# Altium project bg_per.PrjPcb
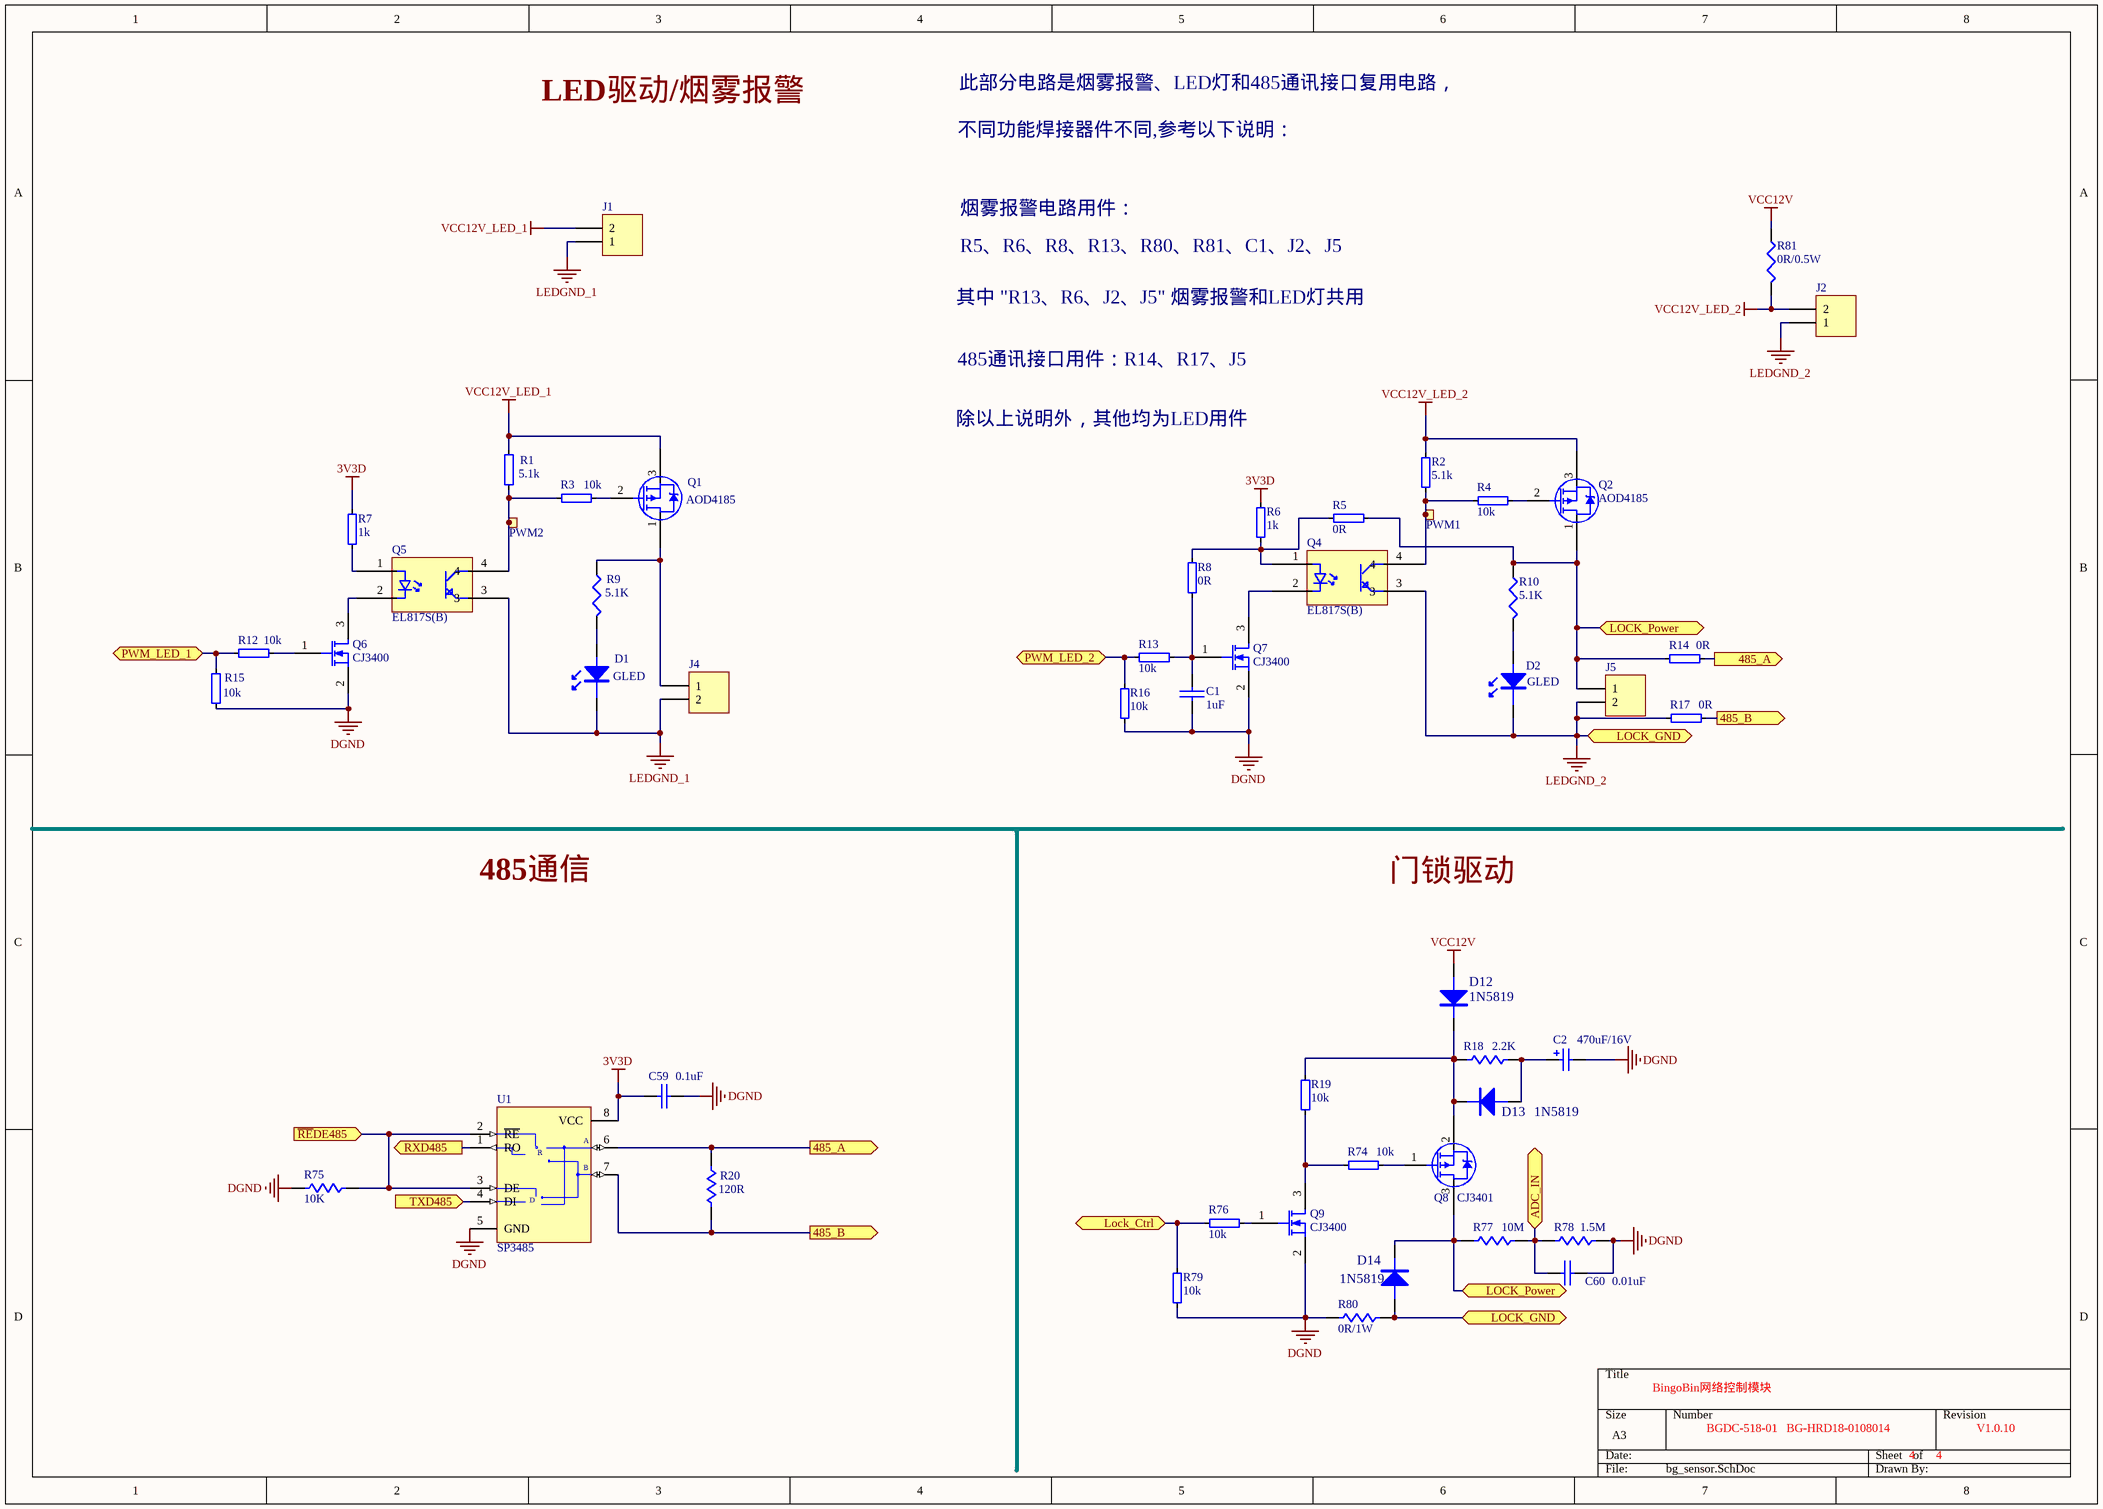
[diagram p0: bg_sensor.SchDoc]
3 sheets, 112 parts. Net scope: flat (ports and power ports of the same name join across sheets).
Board file: bg_PCB.PcbDoc
Sheets:
  bg_sensor.SchDoc
  bg_MCU.SchDoc
  view.SchDoc

## Sheet bg_sensor.SchDoc
size A3

### Parts
C1  1uF  [C0603]
C2  470uF/16V  [C10*10.5mm]
C59  0.1uF  [C0603]
C60  0.01uF  [C0603]
D1  GLED  [LED-0805]
D2  GLED  [LED-0805]
D12  1N5819  [SOD123]
D13  1N5819  [SOD123]
D14  1N5819  [SOD123]
J1  36-57VDC RTN  [MKDS_5_6.35]  (value not drawn)
J2  36-57VDC RTN  [MKDS_5_6.35]  (value not drawn)
J4  36-57VDC RTN  [MKDS_5_6.35]  (value not drawn)
J5  36-57VDC RTN  [MKDS_5_6.35]  (value not drawn)
PWM1  ?.0mm,SMD  [TP_SMD_1mm]  (value not drawn)  (no BOM)
PWM2  ?.0mm,SMD  [TP_SMD_1mm]  (value not drawn)  (no BOM)
Q1  AOD4185  [TO252]
Q2  AOD4185  [TO252]
Q4  EL817S(B)  [LC_SMD-4]
Q5  EL817S(B)  [LC_SMD-4]
Q6  CJ3400  [sot-23]
Q7  CJ3400  [sot-23]
Q8  CJ3401  [sot-23]
Q9  CJ3400  [sot-23]
R1  5.1k  [R0603]
R2  5.1k  [R0603]
R3  10k  [R0603]
R4  10k  [R0603]
R5  0R  [R0603]
R6  1k  [R0603]
R7  1k  [R0603]
R8  0R  [R0603]
R9  5.1K  [R0603]
R10  5.1K  [R0603]
R12  10k  [R0603]
R13  10k  [R0603]
R14  0R  [R0603]
R15  10k  [R0603]
R16  10k  [R0603]
R17  0R  [R0603]
R18  2.2K  [0805]
R19  10k  [R0603]
R20  120R  [R0603]
R74  10k  [R0603]
R75  10K  [R0603]
R76  10k  [R0603]
R77  10M  [R0603]
R78  1.5M  [R0603]
R79  10k  [R0603]
R80  0R/1W  [2512]
R81  0R/0.5W  [1206]
U1  SP3485  [SOIC8]

### Ports
485_A (out), 485_B (out), ADC_IN, Lock_Ctrl, LOCK_GND, LOCK_Power, PWM_LED_1, PWM_LED_2, RXD485 (out), TXD485 (in), ~{RE}DE485 (in)

### Nets
3V3D: C59.1 R6.2 R7.2 U1.8(VCC)
DGND: C1.1 C2.2 C59.2 C60.2 Q6.2(S) Q7.2(S) Q9.2(S) R15.1 R16.1 R75.2 R78.1 R79.1 R80.2 U1.5(GND)
LEDGND_1: D1.2 J1.1 J4.2 Q5.3
LEDGND_2: D2.2 D14.1(A) J2.1 J5.2 Q4.3 R17.1 R80.1 ; port LOCK_GND
VCC12V: D12.1(A) R81.1
VCC12V_LED_1: J1.2 Q1.3(S) R1.2
VCC12V_LED_2: J2.2 Q2.3(S) R2.2 R81.2
NetC1_2: C1.2 Q7.1(G) R8.2 R13.2
NetC2_1: C2.1 D13.1(A) R18.2
NetC60_1: C60.1 R77.1 R78.2 ; port ADC_IN
NetD1_1: D1.1 R9.2
NetD2_1: D2.1 R10.2
NetD12_2: D12.2(K) D13.2(K) Q8.2(S) R18.1 R19.2
NetD14_2: D14.2(K) J5.1 Q2.1(D) Q8.3(D) R5.1 R10.1 R14.1 R77.2 ; port LOCK_Power
NetJ4_1: J4.1 Q1.1(D) R9.1
NetPWM1_1: PWM1.1 Q4.4 R2.1 R4.1
NetPWM2_1: PWM2.1 Q5.4 R1.1 R3.1
NetQ1_2: Q1.2(G) R3.2
NetQ2_2: Q2.2(G) R4.2
NetQ4_1: Q4.1 R5.2 R6.1 R8.1
NetQ4_2: Q4.2 Q7.3(D)
NetQ5_1: Q5.1 R7.1
NetQ5_2: Q5.2 Q6.3(D)
NetQ6_1: Q6.1(G) R12.2
NetQ8_1: Q8.1(G) R74.2
NetQ9_1: Q9.1(G) R76.2
NetQ9_3: Q9.3(D) R19.1 R74.1
NetR12_1: R12.1 R15.2 ; port PWM_LED_1
NetR13_1: R13.1 R16.2 ; port PWM_LED_2
NetR14_2: R14.2 R20.2 U1.6(A) ; port 485_A
NetR17_2: R17.2 R20.1 U1.7(B) ; port 485_B
NetR75_1: R75.1 U1.2(~{RE}) U1.3(DE) ; port ~{RE}DE485
NetR76_1: R76.1 R79.2 ; port Lock_Ctrl
NetU1_1: U1.1(RO) ; port RXD485
NetU1_4: U1.4(DI) ; port TXD485

### Notes on the sheet
- LED驱动/烟雾报警
- 此部分电路是烟雾报警、LED灯和485通讯接口复用电路，
- 不同功能焊接器件不同,参考以下说明：
- 烟雾报警电路用件：
- 其中 "R13、R6、J2、J5" 烟雾报警和LED灯共用
- R5、R6、R8、R13、R80、R81、C1、J2、J5
- 485通讯接口用件：R14、R17、J5
- 除以上说明外，其他均为LED用件
- 485通信
- 门锁驱动
- BingoBin网络控制模块
- BGDC-518-01   BG-HRD18-0108014
- 4
- V1.0.10
- (in symbol SP3485) R; D

### Library data of the parts
C1 C59 C60 = C0603: Capacitor, Ceramic, 0.1uF, 16V, 10%, 0603, X7R
  C1: Value: 1uF
  C59: Value: 0.1uF
  C60: Value: 0.01uF
C2 = Cap Pol2: Capacitor, Aluminum Electrolytic, 470uF,16V, 20%; Published: 8-Jun-2000; LatestRevisionDate: 17-Jul-2002; LatestRevisionNote: Re-released for DXP Platform.; PackageReference: POLAR0.8; Publisher: Altium Limited; PackageDescription: Polarized Capacitor; 2 Leads; Value: 470uF/16V
D1 D2 = LED_0805: 翠绿色 贴片LED ( Iv=220-270mcd @IF=5mA)
D12-D14 = DIODE: Diode Schottky, 40V,1A
J1 J2 J4 J5 = Header 2: WJ15EDGVC-3.81-2P; LatestRevisionDate: 17-Jul-2002; LatestRevisionNote: Re-released for DXP Platform.; Publisher: Altium Limited
PWM1 PWM2 = TESTPAD: 1.0mm circular SMD testpad; Part Number: TP_SMD_?.0MM; Manufacturer: Nordic Semiconductor; Artikkelnr Noca: N.A.; Manufacturer Part Number: *; Datasheet: *; LatestRevisionDate: 2013-06-11; Pin Count: 1; Publisher: Nordic Semiconductor; Published: 2013-06-11; Value: ?.0mm,SMD; Note: *; Supplier: *; Supplier part number: *; 2nd source Supplier: *; 2nd source part number: *; Footprint Doc: TP_SMD_?.0mm; Artikkelnr Simpro: N.A.
Q1 Q2 = PMOS: AOD4185(TO-252-2)
Q4 Q5 = Optocoupler: EL817S(B)(TU)-F
Q6 Q7 Q9 = MOSFET-N: N沟道,30V,5.6A,27mΩ(Typ,@Vgs=4.5V); Published: 8-Jun-2000; LatestRevisionDate: 17-Jul-2002; LatestRevisionNote: Re-released for DXP Platform.; PackageVersion: 1995/1996; PackageReference: E3; Publisher: Altium Limited; PackageDescription: TO, Flat Index; 3 In-Line, Axial Leads; Body Dia. 4.6mm; Lead Dia. 0.5 mm (max)
Q8 = PMOS-2: CJ3401(SOT-23-3)
R1-R8 R12-R17 R19 R74 R76 R79 = R0402-12k: RES, THICK FILM, 10K, 5%, 1/10W, 0603; Part Number: R0402-10k; Note: Chip Res 1%; Artikkelnr Noca: 27049099; Manufacturer: *; Manufacturer Part Number: *; Datasheet: *; Footprint: 0402; LatestRevisionDate: 2009-11-23; Pin Count: 2; Publisher: Nordic Semiconductor; Published: 2009-05-08; Supplier: Farnell; Supplier part number: 173-8865; 2nd source Supplier: *; 2nd source part number: *
  R1 R2: Value: 5.1k
  R3 R4 R12 R13 R15 R16 R19 R74 R76 R79: Value: 10k
  R5 R8 R14 R17: Value: 0R
  R6 R7: Value: 1k
R9 R10 = Res3: RES, THICK FILM, 1K, 5%, 1/10W, 0603; Published: 8-Jun-2000; LatestRevisionDate: 29-May-2009; LatestRevisionNote: IPC-7351 Footprint Added.; PackageReference: J1-0603; Publisher: Altium Limited; PackageDescription: Chip Resistor; Value: 5.1K
R18 = R0603: RES, THICK FILM, 2.2K, 5%, 1/8W, 0805; Value: 2.2K
R20 = R0603: RES, THICK FILM, 120 OHM, 5%, 1/10W, 0603; Value: 120R
R75 = R0603: RES, THICK FILM, 10K, 5%, 1/10W, 0603; Value: 10K
R77 = R0603: RES, THICK FILM, 10M, 5%, 1/10W, 0603; Value: 10M
R78 R80 = R0603: RES, THICK FILM, 1.5M, 5%, 1/10W, 0603
  R78: Value: 1.5M
  R80: Value: 0R/1W
R81 = Res3: RES, THICK FILM, 0.39 OHM, 1%, 3/4W, 2010; Published: 8-Jun-2000; LatestRevisionDate: 29-May-2009; LatestRevisionNote: IPC-7351 Footprint Added.; PackageReference: J1-0603; Publisher: Altium Limited; PackageDescription: Chip Resistor; Value: 0R/0.5W
U1 = SP3485: +3.3V Low Power Half-Duplex RS-485 Transceiver with 10Mbps Data Rate

## Sheet bg_MCU.SchDoc
size A2
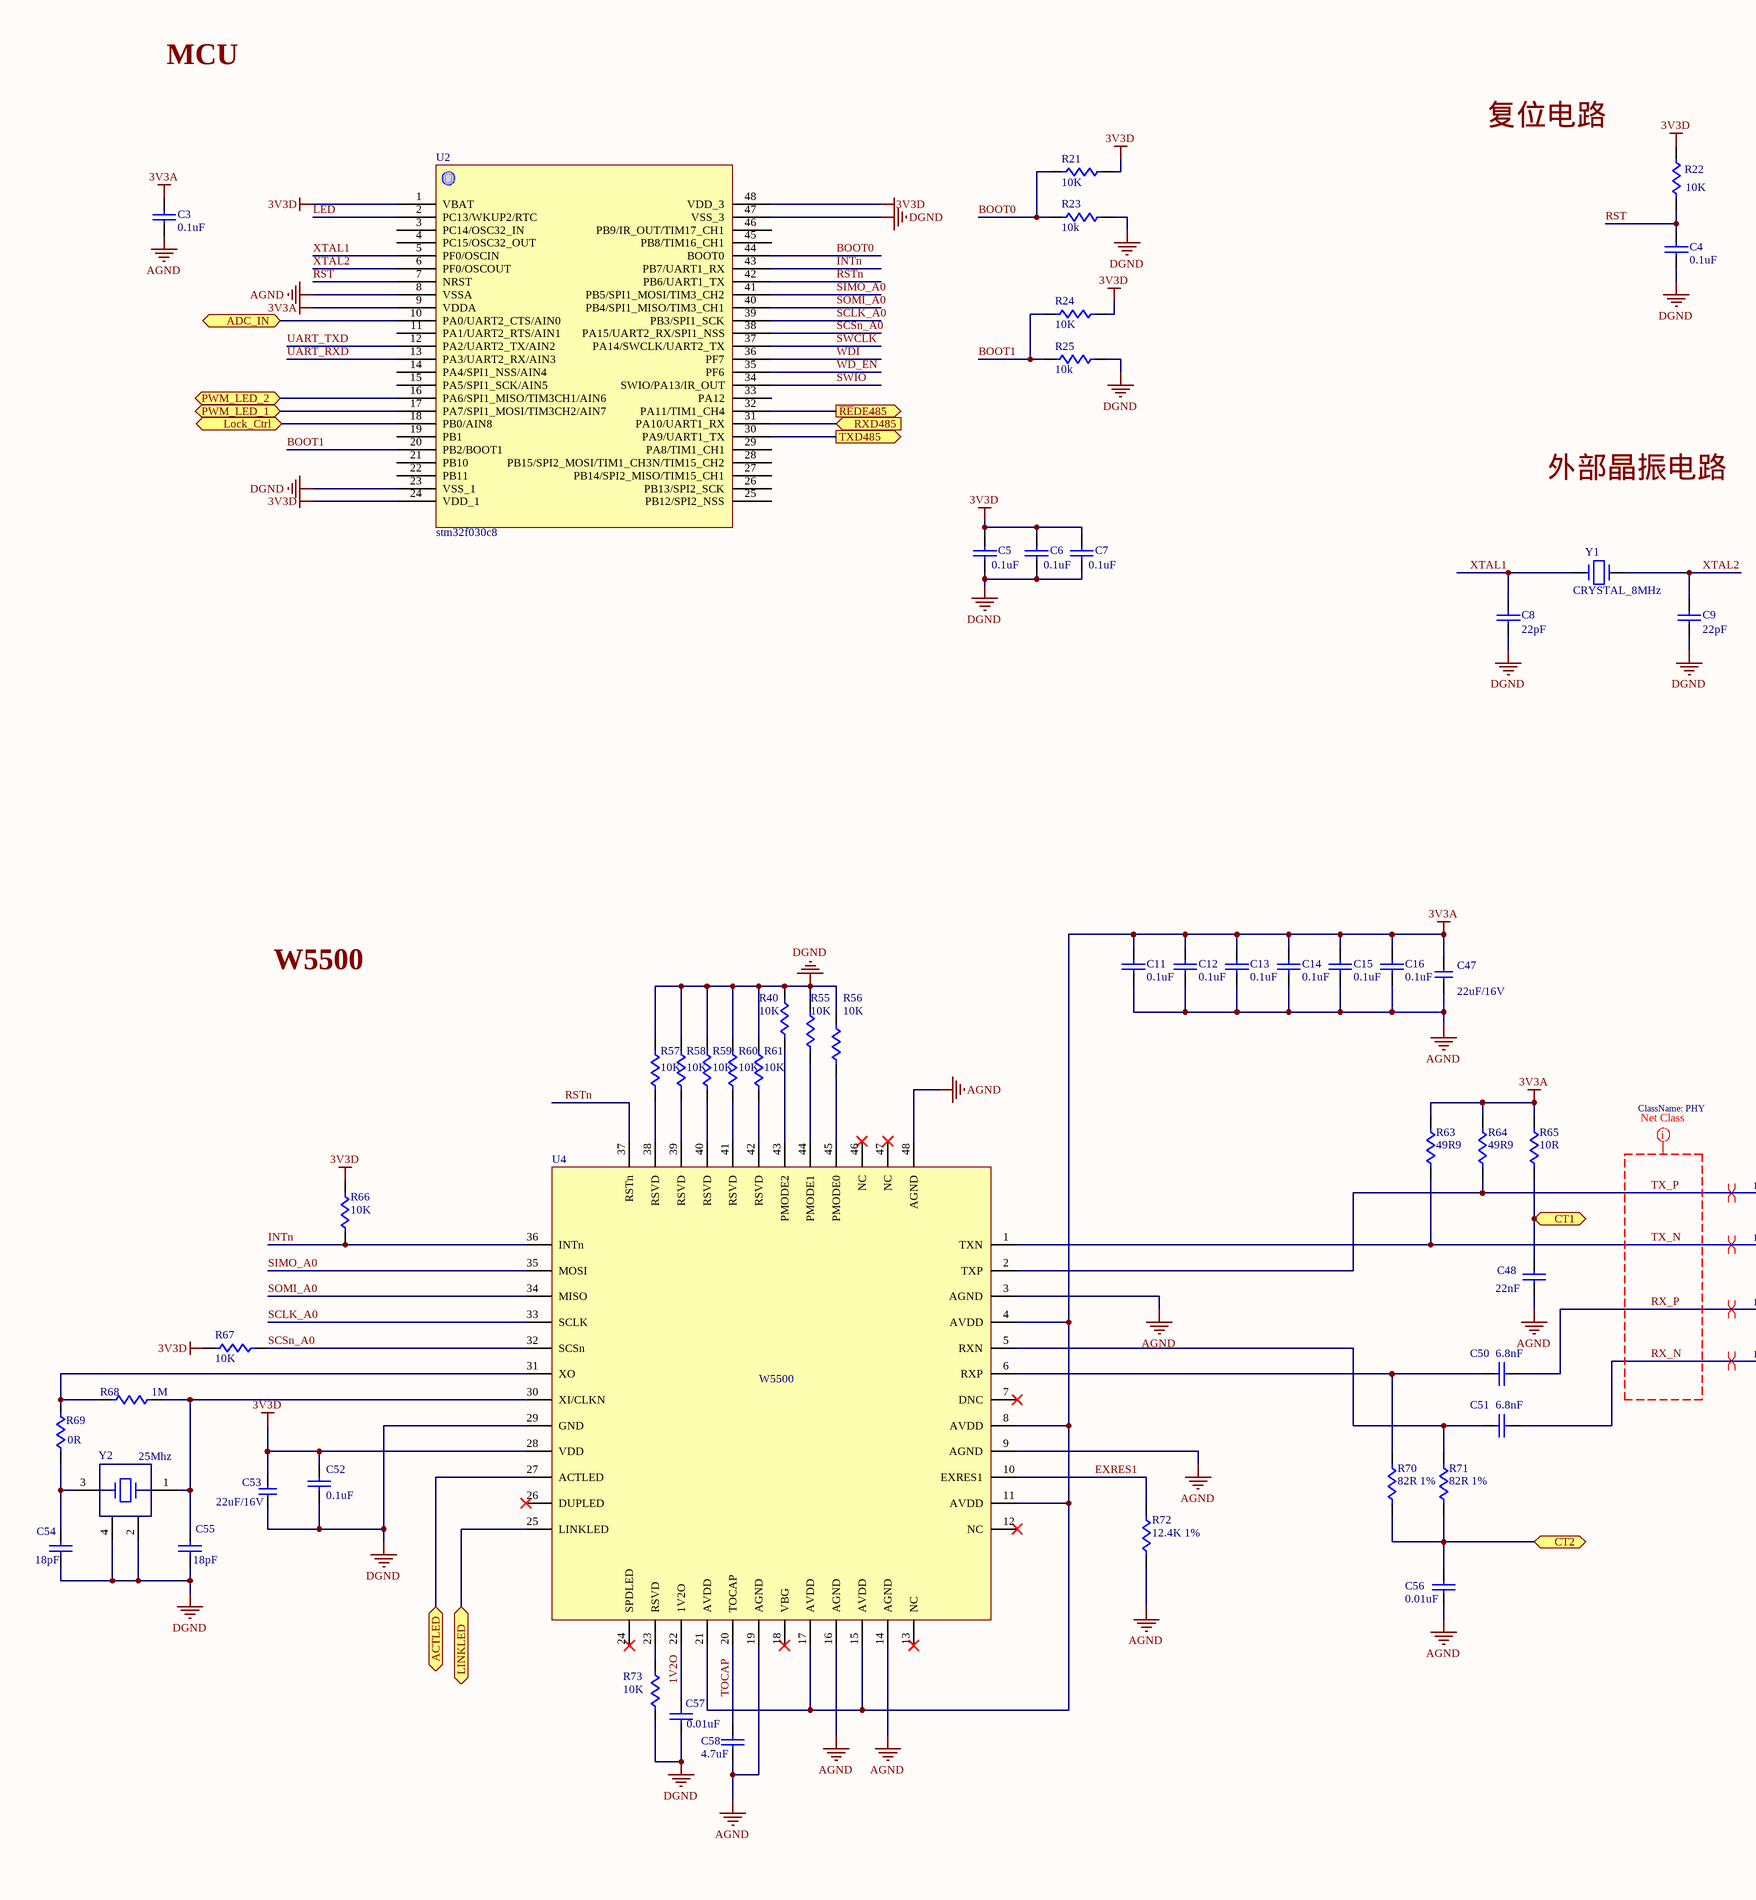
[diagram p1: bg_MCU.SchDoc, left]
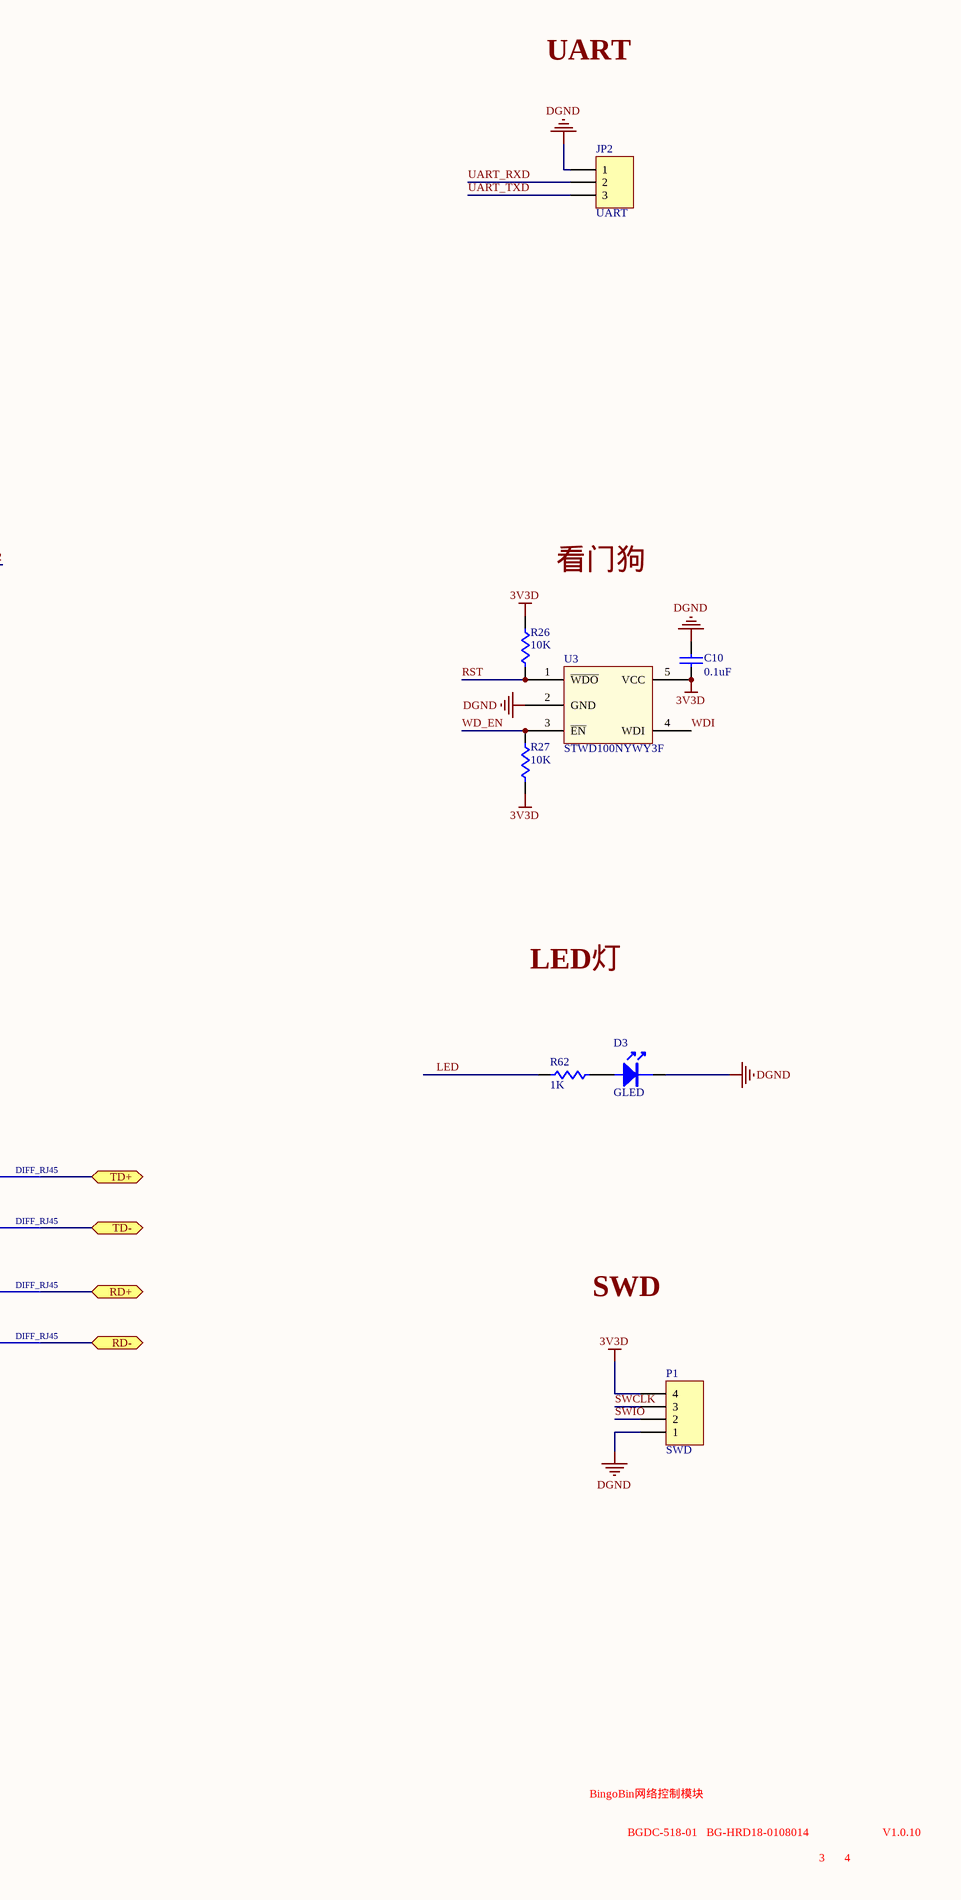
[diagram p2: bg_MCU.SchDoc, right]

### Parts
C3  0.1uF  [C0603]
C4  0.1uF  [C0603]
C5  0.1uF  [C0603]
C6  0.1uF  [C0603]
C7  0.1uF  [C0603]
C8  22pF  [C0603]
C9  22pF  [C0603]
C10  0.1uF  [C0603]
C11  0.1uF  [C0603]
C12  0.1uF  [C0603]
C13  0.1uF  [C0603]
C14  0.1uF  [C0603]
C15  0.1uF  [C0603]
C16  0.1uF  [C0603]
C47  22uF/16V  [C1210]
C48  22nF  [C0603]
C50  6.8nF  [C0603]
C51  6.8nF  [C0603]
C52  0.1uF  [C0603]
C53  22uF/16V  [C1210]
C54  18pF  [C0603]
C55  18pF  [C0603]
C56  0.01uF  [C0603]
C57  0.01uF  [C0603]
C58  4.7uF  [C0603]
D3  GLED  [LED-0805]
JP2  UART  [HDR1X3]
P1  SWD  [HDR1X4]
R21  10K  [R0603]
R22  10K  [R0603]
R23  10k  [R0603]
R24  10K  [R0603]
R25  10k  [R0603]
R26  10K  [R0603]
R27  10K  [R0603]
R40  10K  [R0603]
R55  10K  [R0603]
R56  10K  [R0603]
R57  10K  [R0603]
R58  10K  [R0603]
R59  10K  [R0603]
R60  10K  [R0603]
R61  10K  [R0603]
R62  1K  [R0603]
R63  49R9  [R0603]
R64  49R9  [R0603]
R65  10R  [R0603]
R66  10K  [R0603]
R67  10K  [R0603]
R68  1M  [R0603]
R69  0R  [R0603]
R70  82R 1%  [R0603]
R71  82R 1%  [R0603]
R72  12.4K 1%  [R0603]
R73  10K  [R0603]
U2  stm32f030c8  [LQFP48]
U3  STWD100NYWY3F  [SOT23-5]
U4  W5500  [W5500-LQFP-48_7x7x05P]
Y1  CRYSTAL_8MHz  [8M_SMD_CRYSTAL]
Y2  25Mhz  [25MHz-SMD-3225_4P]

### Ports
ACTLED (bidir), ADC_IN, CT1 (bidir), CT2 (bidir), LINKLED (bidir), Lock_Ctrl, PWM_LED_1, PWM_LED_2, RD+ (bidir), RD- (bidir), RXD485 (in), TD+ (bidir), TD- (bidir), TXD485 (out), ~{RE}DE485 (out)

### Nets
3V3A: C3.1 C11.1 C12.1 C13.1 C14.1 C15.1 C16.1 C47.2 R63.2 R64.2 R65.2 U2.9(VDDA) U4.4(AVDD) U4.8(AVDD) U4.11(AVDD) U4.15(AVDD) U4.17(AVDD) U4.21(AVDD)
3V3D: C5.2 C6.2 C7.2 C10.2 C52.1 C53.2 P1.4 R21.1 R22.2 R24.1 R26.2 R27.1 R66.2 R67.2 U2.1(VBAT) U2.24(VDD_1) U2.48(VDD_3) U3.5(VCC) U4.28(VDD)
AGND: C3.2 C11.2 C12.2 C13.2 C14.2 C15.2 C16.2 C47.1 C48.2 C56.2 C58.2 R72.1 U2.8(VSSA) U4.3(AGND) U4.9(AGND) U4.14(AGND) U4.16(AGND) U4.19(AGND) U4.48(AGND)
DGND: C4.1 C5.1 C6.1 C7.1 C8.2 C9.2 C10.1 C52.2 C53.1 C54.2 C55.2 C57.2 D3.2 JP2.1 P1.1 R23.1 R25.1 R40.2 R55.2 R56.2 R57.2 R58.2 R59.2 R60.2 R61.2 R73.1 U2.23(VSS_1) U2.47(VSS_3) U3.2(GND) U4.29(GND) Y2.2 Y2.4
1V2O: C57.1 U4.22(1V2O)
BOOT0: R21.2 R23.2 U2.44(BOOT0)
BOOT1: R24.2 R25.2 U2.20(PB2/BOOT1)
EXRES1: R72.2 U4.10(EXRES1)
INTn: R66.1 U2.43(PB7/UART1_RX) U4.36(INTn)
LED: R62.2 U2.2(PC13/WKUP2/RTC)
RST: C4.2 R22.1 R26.1 U2.7(NRST) U3.1(~{WDO})
RSTn: U2.42(PB6/UART1_TX) U4.37(RSTn)
RX_N: C51.2 ; port RD-
RX_P: C50.2 ; port RD+
SCLK_A0: U2.39(PB3/SPI1_SCK) U4.33(SCLK)
SCSn_A0: R67.1 U2.38(PA15/UART2_RX/SPI1_NSS) U4.32(SCSn)
SIMO_A0: U2.41(PB5/SPI1_MOSI/TIM3_CH2) U4.35(MOSI)
SOMI_A0: U2.40(PB4/SPI1_MISO/TIM3_CH1) U4.34(MISO)
SWCLK: P1.3 U2.37(PA14/SWCLK/UART2_TX)
SWIO: P1.2 U2.34(SWIO/PA13/IR_OUT)
TOCAP: C58.1 U4.20(TOCAP)
TX_N: R63.1 U4.1(TXN) ; port TD-
TX_P: R64.1 U4.2(TXP) ; port TD+
UART_RXD: JP2.2 U2.13(PA3/UART2_RX/AIN3)
UART_TXD: JP2.3 U2.12(PA2/UART2_TX/AIN2)
WD_EN: R27.2 U2.35(PF6) U3.3(~{EN})
WDI: U2.36(PF7) U3.4(WDI)
XTAL1: C8.1 U2.5(PF0/OSCIN) Y1.1
XTAL2: C9.1 U2.6(PF0/OSCOUT) Y1.2
NetC48_1: C48.1 R65.1 ; port CT1
NetC50_1: C50.1 R70.2 U4.6(RXP)
NetC51_1: C51.1 R71.2 U4.5(RXN)
NetC54_1: C54.1 R69.1 Y2.3
NetC55_1: C55.1 R68.1 U4.30(XI/CLKN) Y2.1
NetC56_1: C56.1 R70.1 R71.1 ; port CT2
NetC60_1: U2.10(PA0/UART2_CTS/AIN0) ; port ADC_IN
NetD3_1: D3.1 R62.1
NetR12_1: U2.17(PA7/SPI1_MOSI/TIM3CH2/AIN7) ; port PWM_LED_1
NetR13_1: U2.16(PA6/SPI1_MISO/TIM3CH1/AIN6) ; port PWM_LED_2
NetR40_1: R40.1 U4.43(PMODE2)
NetR55_1: R55.1 U4.44(PMODE1)
NetR56_1: R56.1 U4.45(PMODE0)
NetR57_1: R57.1 U4.38(RSVD)
NetR58_1: R58.1 U4.39(RSVD)
NetR59_1: R59.1 U4.40(RSVD)
NetR60_1: R60.1 U4.41(RSVD)
NetR61_1: R61.1 U4.42(RSVD)
NetR68_2: R68.2 R69.2 U4.31(XO)
NetR73_2: R73.2 U4.23(RSVD)
NetR75_1: U2.32(PA11/TIM1_CH4) ; port ~{RE}DE485
NetR76_1: U2.18(PB0/AIN8) ; port Lock_Ctrl
NetU1_1: U2.31(PA10/UART1_RX) ; port RXD485
NetU1_4: U2.30(PA9/UART1_TX) ; port TXD485
NetU4_25: U4.25(LINKLED) ; port LINKLED
NetU4_27: U4.27(ACTLED) ; port ACTLED

Not connected (* = marked no-connect by the designer): U2 3(PC14/OSC32_IN) 4(PC15/OSC32_OUT) 11(PA1/UART2_RTS/AIN1) 14(PA4/SPI1_NSS/AIN4) 15(PA5/SPI1_SCK/AIN5) 19(PB1) 21(PB10) 22(PB11) 25(PB12/SPI2_NSS) 26(PB13/SPI2_SCK) 27(PB14/SPI2_MISO/TIM15_CH1) 28(PB15/SPI2_MOSI/TIM1_CH3N/TIM15_CH2) 29(PA8/TIM1_CH1) 33(PA12) 45(PB8/TIM16_CH1) 46(PB9/IR_OUT/TIM17_CH1); U4 7(DNC)* 12(NC)* 13(NC)* 18(VBG)* 24(SPDLED)* 26(DUPLED)* 46(NC)* 47(NC)*

### Layout directives
differential pair; net class DIFF_RJ45: RX_N, RX_P, TX_N, TX_P
net class PHY: RX_N, RX_P, TX_N, TX_P

### Notes on the sheet
- MCU
- UART
- 复位电路
- 外部晶振电路
- 看门狗
- W5500
- LED灯
- SWD
- BingoBin网络控制模块
- BGDC-518-01   BG-HRD18-0108014
- 3
- 4
- V1.0.10

### Library data of the parts
C3-C7 C10-C16 C52 = C0603: as C1 on sheet bg_sensor; Value: 0.1uF
C8 C9 = C0603: Capacitor, Ceramic, 22pF, 50V, 5%, 0603, COG; Value: 22pF
C47 C53 = CAP_0603: Capacitor, Ceramic, 10uF,16V, 10%,1210,X5R; Part Number: C0603-4µ7; Note: 6.3V; Artikkelnr Noca: 20069060; Artikkelnr Simpro: N.A.; Manufacturer: *; Manufacturer Part Number: *; Datasheet: *; LatestRevisionDate: 2009-11-23; Pin Count: 2; Publisher: Nordic Semiconductor; Published: 2009-05-08; Value: 22uF/16V; Supplier: *; Supplier part number: *; 2nd source Supplier: *; 2nd source part number: *; Footprint Doc: 0603
C48 = C0603: Capacitor, Ceramic, 22nF, 25V, 10%, 0603, X7R; Value: 22nF
C50 C51 = C0603: Capacitor, Ceramic, 6.8nF, 50V, 10%, 0603, X7R; Value: 6.8nF
C54 C55 = C0603: Capacitor, Ceramic, 18pF, 50V, 5%, 0603, COG; Value: 18pF
C56 C57 = C0603: Capacitor, Ceramic, 0.01uF, 50V, 10%, 0603, X7R; Value: 0.01uF
C58 = C0603: Capacitor, Ceramic, 4.7uF, 16V, 10%, 0603, X7R; Value: 4.7uF
D3 = LED_0805: 翠绿色 贴片LED ( Iv=220-270mcd @IF=5mA)
JP2 = Header 3: Header, 3-Pin, Single row; LatestRevisionDate: 17-Jul-2002; LatestRevisionNote: Re-released for DXP Platform.; Publisher: Altium Limited
P1 = Header 4: Header, 4-Pin; LatestRevisionDate: 17-Jul-2002; LatestRevisionNote: Re-released for DXP Platform.; Publisher: Altium Limited
R21-R25 = R0603: RES, THICK FILM, 4.7K, 5%, 1/10W, 0603
  R21 R22 R24: Value: 10K
  R23 R25: Value: 10k
R26 R27 R40 R55-R61 R66 R67 R73 = R0603: RES, THICK FILM, 10K, 5%, 1/10W, 0603; Value: 10K
R62 = R0603: RES, THICK FILM, 1K, 5%, 1/10W, 0603; Value: 1K
R63 R64 = R0603: RES, THICK FILM, 49.9 OHM, 1%, 1/10W, 0603; Value: 49R9
R65 = R0603: RES, THICK FILM, 10 OHM, 5%, 1/10W, 0603; Value: 10R
R68 = R0603: RES, THICK FILM, 1M, 5%, 1/10W, 0603; Value: 1M
R69 = R0603: RES, THICK FILM, 0 OHM, 1%, 1/10W, 0603; Value: 0R
R70 R71 = R0603: RES, THICK FILM, 82 OHM, 5%, 1/10W, 0603; Value: 82R 1%
R72 = R0603: RES, THICK FILM, 12.4K, 1%, 1/10W, 0603; Value: 12.4K 1%
U2 = stm32f030c8: mcu  LQFP-48_7x7x05P
U3 = STWD100: Watchdog timer circuit/1.6s; PCB DECAL: *; Source_Path: *; Value: *
U4 = W5500: TCP/IP嵌入式以太网控制器
Y1 = CRYSTAL_32.768k: 20PF 20PPM -40~+85℃ 编带
Y2 = 25Mhz: XTAL S3225 25M 12pF 10ppm 40R -20~70℃

## Sheet view.SchDoc
size A4
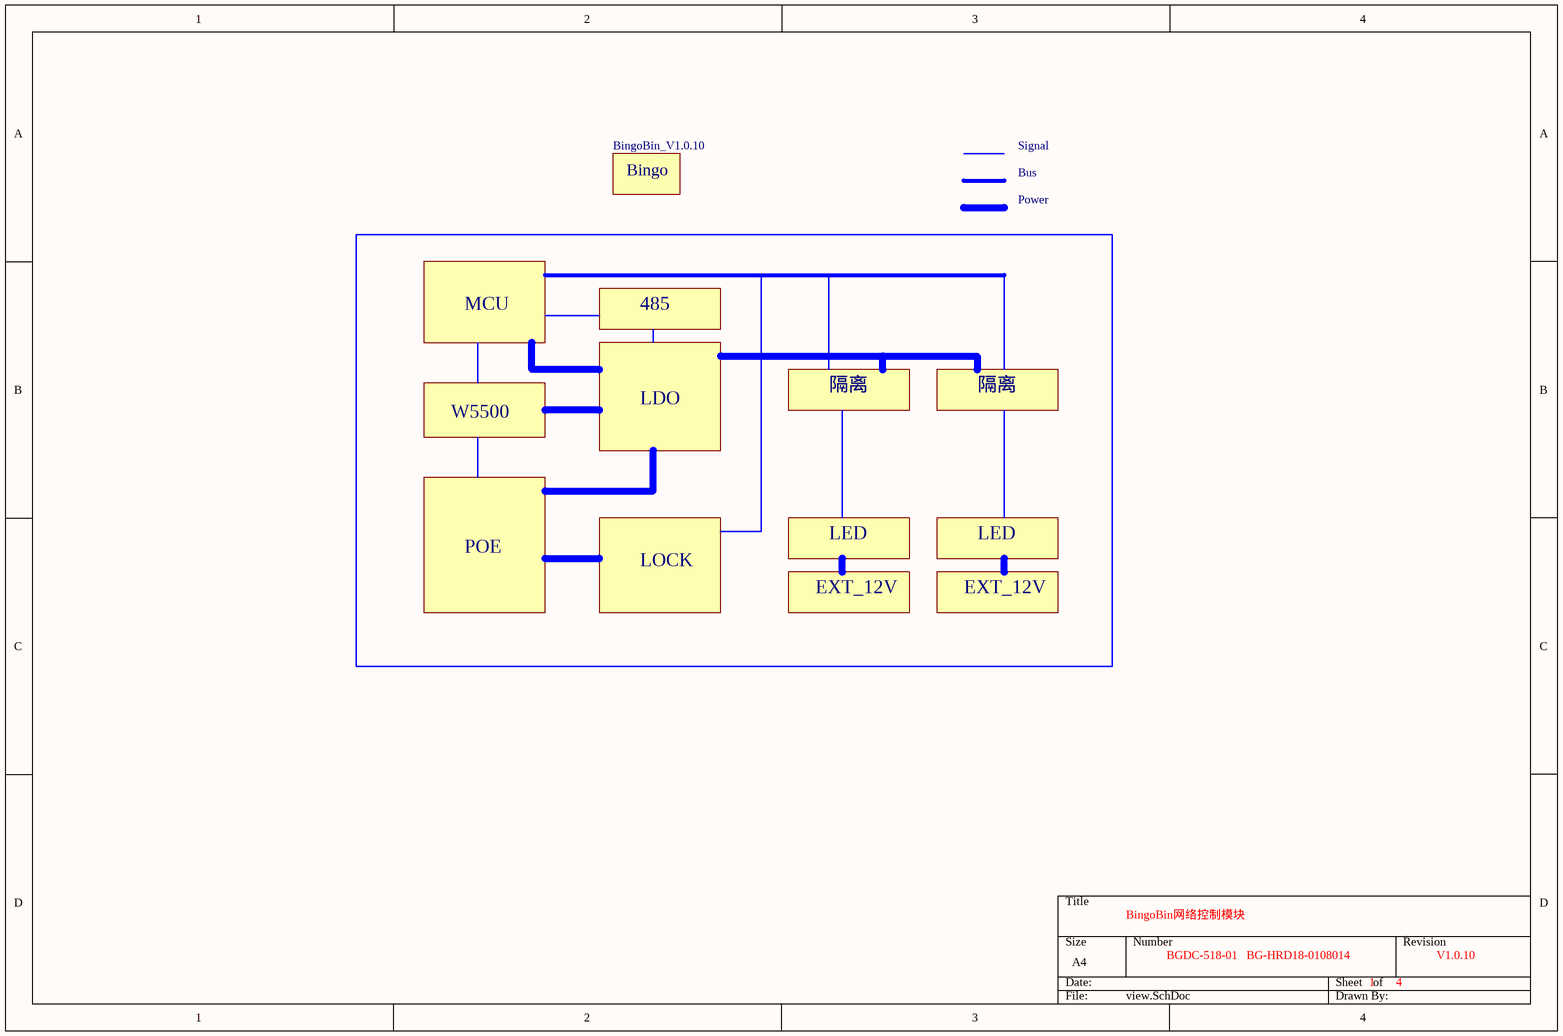
[diagram p3: view.SchDoc]

### Parts
BingoBin_V1.0.10  BingoBin_V1.0.10  [bingo_logo]  (value not drawn)

### Notes on the sheet
- Signal
- Bus
- Power
- MCU
- 485
- W5500
- LDO
- 隔离
- POE
- LOCK
- LED
- EXT_12V
- BingoBin网络控制模块
- BGDC-518-01   BG-HRD18-0108014
- 1
- 4
- V1.0.10
- (in symbol bingo_logo) Bingo

### Library data of the parts
BingoBin_V1.0.10 = bingo_logo: bingo logo; value: BingoBin_V1.0.10

## Nets that join several sheets
3V3D: bg_sensor (C59.1 R6.2 R7.2 U1.8), bg_MCU (19 pins)
DGND: bg_sensor (14 pins), bg_MCU (32 pins)
NetC60_1: bg_sensor (C60.1 R77.1 R78.2), bg_MCU (U2.10)
NetR12_1: bg_sensor (R12.1 R15.2), bg_MCU (U2.17)
NetR13_1: bg_sensor (R13.1 R16.2), bg_MCU (U2.16)
NetR75_1: bg_sensor (R75.1 U1.2 U1.3), bg_MCU (U2.32)
NetR76_1: bg_sensor (R76.1 R79.2), bg_MCU (U2.18)
NetU1_1: bg_sensor (U1.1), bg_MCU (U2.31)
NetU1_4: bg_sensor (U1.4), bg_MCU (U2.30)